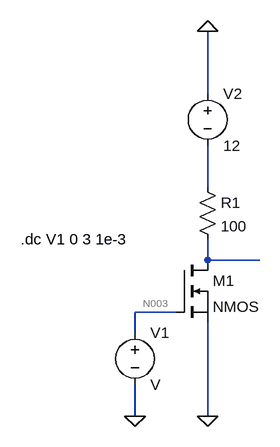
[diagram p0: schematic projekt.asc]
projekt.asc, the LTspice schematic file:
Version 4
SHEET 1 880 680
WIRE 208 -192 208 -288
WIRE 208 -48 208 -112
WIRE 208 64 208 32
WIRE 288 64 208 64
WIRE 160 144 96 144
WIRE 96 176 96 144
WIRE 96 304 96 256
WIRE 208 304 208 160
FLAG 96 304 0
FLAG 208 304 0
FLAG 208 -288 0
SYMBOL voltage 96 160 R0
SYMATTR InstName V1
SYMBOL nmos 160 64 R0
SYMATTR InstName M1
SYMBOL res 192 -64 R0
SYMATTR InstName R1
SYMATTR Value 100
SYMBOL voltage 208 -208 R0
WINDOW 123 0 0 Left 2
WINDOW 39 0 0 Left 2
SYMATTR InstName V2
SYMATTR Value 12
TEXT -80 32 Left 2 !.dc V1 0 3 1e-3

The netlist it stands for:
* projekt.asc
V1 N003 0 V
M1 N002 N003 0 0 NMOS
R1 N001 N002 100
V2 0 N001 12
.model NMOS NMOS
.model PMOS PMOS
.lib standard.mos
.dc V1 0 3 1e-3
.backanno
.end

* Results of the author's LTspice run, read from the files saved beside the schematic
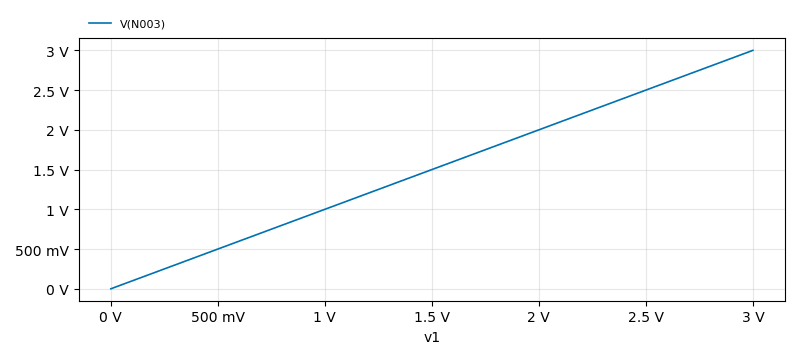
[diagram p1: DC transfer characteristic of projekt.asc, plotted from the saved traces]
* DC transfer characteristic, 1 run:
*   V(N003): 0 V at v1=0 V, 3 V at v1=3 V, min 0 V, max 3 V